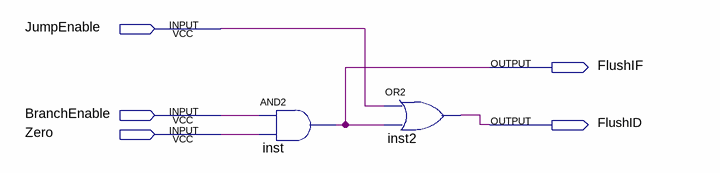
[diagram p0: schematic sheet]
// Quartus schematic flush.bdf as structural Verilog: 2 symbols, 5 pins
module flush (
  input  JumpEnable,
  input  BranchEnable,
  input  Zero,
  output FlushIF,
  output FlushID
);

  and inst (FlushIF, BranchEnable, Zero);
  or inst2 (FlushID, JumpEnable, FlushIF);
endmodule
